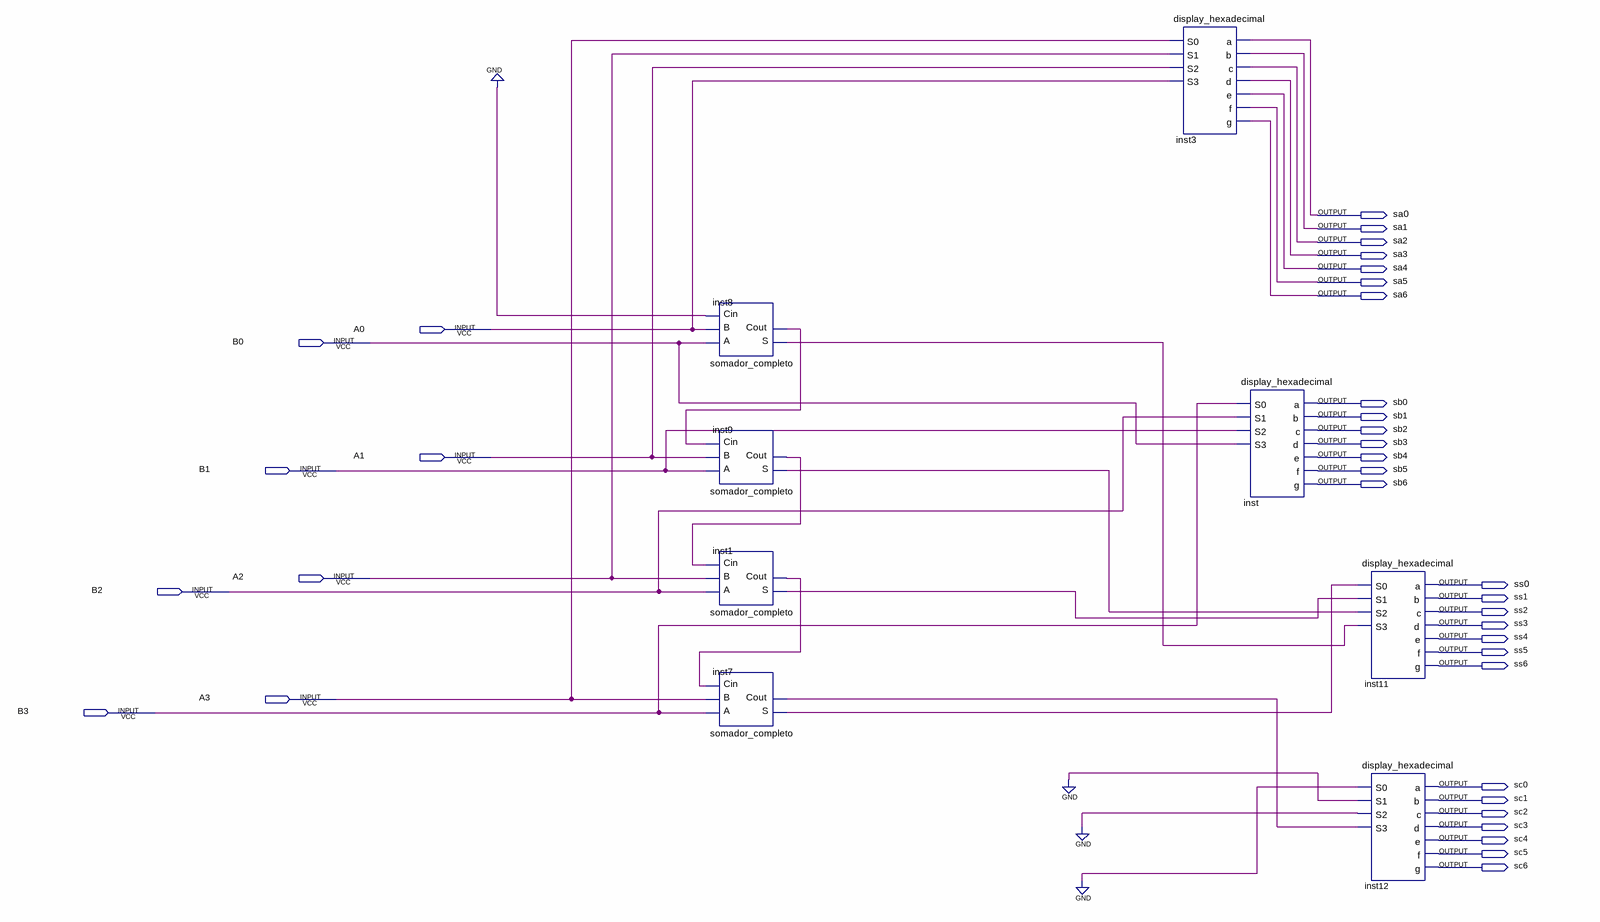
[diagram p0: schematic sheet]
// Quartus schematic aula06.bdf as structural Verilog: 8 symbols, 36 pins
module aula06 (
  input  A0,
  input  B0,
  input  A1,
  input  B1,
  input  A2,
  input  B2,
  input  A3,
  input  B3,
  output sa0,
  output sa1,
  output sa2,
  output sa3,
  output sa4,
  output sa5,
  output sa6,
  output sb0,
  output sb1,
  output sb2,
  output sb3,
  output sb4,
  output sb5,
  output sb6,
  output ss0,
  output ss1,
  output ss2,
  output ss3,
  output ss4,
  output ss5,
  output ss6,
  output sc0,
  output sc1,
  output sc2,
  output sc3,
  output sc4,
  output sc5,
  output sc6
);

  wire inst1_cout, inst1_s, inst7_cout, inst7_s, inst8_cout, inst8_s, inst9_cout, inst9_s;

  somador_completo inst8 (.A(B0), .B(A0), .Cin(1'b0), .S(inst8_s), .Cout(inst8_cout));
  somador_completo inst9 (.A(B1), .B(A1), .Cin(inst8_cout), .S(inst9_s), .Cout(inst9_cout));
  somador_completo inst1 (.A(B2), .B(A2), .Cin(inst9_cout), .S(inst1_s), .Cout(inst1_cout));
  somador_completo inst7 (.A(B3), .B(A3), .Cin(inst1_cout), .S(inst7_s), .Cout(inst7_cout));
  display_hexadecimal inst3 (
    .S0(A3), .S1(A2), .S2(A1), .S3(A0), .a(sa0), .b(sa1), .c(sa2), .d(sa3), .e(sa4), .f(sa5), .g(sa6));
  display_hexadecimal inst (
    .S0(B3), .S1(B2), .S2(B1), .S3(B0), .a(sb0), .b(sb1), .c(sb2), .d(sb3), .e(sb4), .f(sb5), .g(sb6));
  display_hexadecimal inst11 (
    .S0(inst7_s), .S1(inst1_s), .S2(inst9_s), .S3(inst8_s), .a(ss0), .b(ss1), .c(ss2), .d(ss3), .e(ss4),
    .f(ss5), .g(ss6));
  display_hexadecimal inst12 (
    .S0(1'b0), .S1(1'b0), .S2(1'b0), .S3(inst7_cout), .a(sc0), .b(sc1), .c(sc2), .d(sc3), .e(sc4), .f(sc5),
    .g(sc6));
endmodule
